# Altium schematic sheet Battery Management System.SchDoc
size A; SheetNumber: 2; SheetTotal: 3
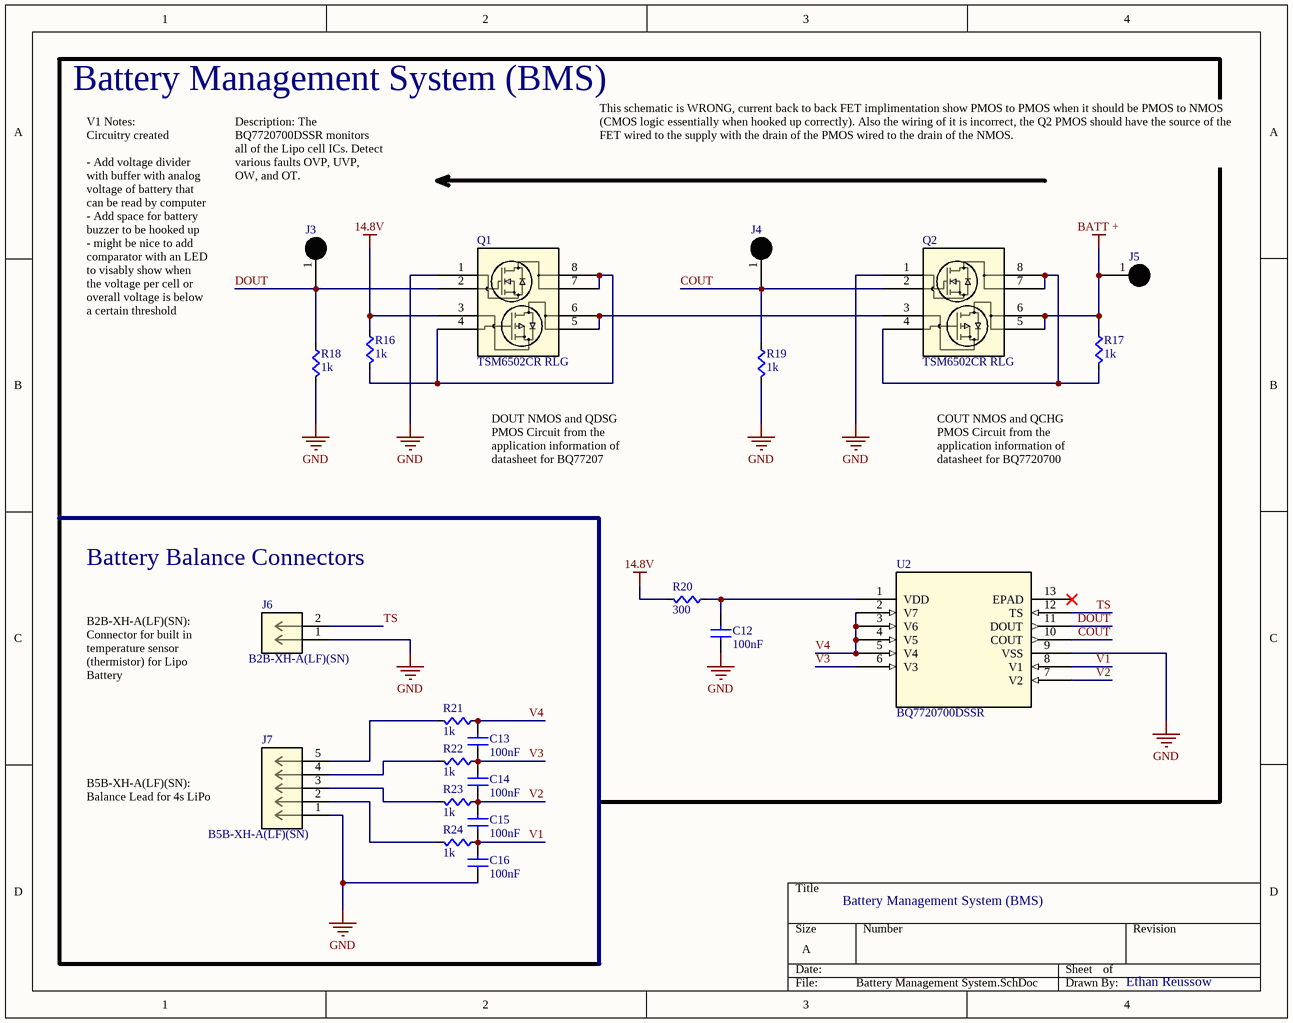
[diagram p0: Battery Management System.SchDoc]

## Parts
C12  value 100nF  [CAPC0603]  (hidden comment: Cap)
C13  value 100nF  [CAPC0603]  (hidden comment: Cap)
C14  value 100nF  [CAPC0603]  (hidden comment: Cap)
C15  value 100nF  [CAPC0603]  (hidden comment: Cap)
C16  value 100nF  [CAPC0603]  (hidden comment: Cap)
J3  5000 Test Point  [5000 Test Point]  (value not drawn)
J4  5000 Test Point  [5000 Test Point]  (value not drawn)
J5  5000 Test Point  [5000 Test Point]  (value not drawn)
J6  B2B-XH-A(LF)(SN)  [CONN_B2B-XH-A(LF)(SN)_JST]
J7  B5B-XH-A(LF)(SN)  [CONN_B5B-XH-A(LF)(SN)_JST]
Q1  TSM6502CR RLG  [PDFN56U_DUAL_TWS]
Q2  TSM6502CR RLG  [PDFN56U_DUAL_TWS]
R16  value 1k  [RES0603]  (hidden comment: Res)
R17  value 1k  [RES0603]  (hidden comment: Res)
R18  value 1k  [RES0603]  (hidden comment: Res)
R19  value 1k  [RES0603]  (hidden comment: Res)
R20  value 300  [RES0603]  (hidden comment: Res)
R21  value 1k  [RES0603]  (hidden comment: Res)
R22  value 1k  [RES0603]  (hidden comment: Res)
R23  value 1k  [RES0603]  (hidden comment: Res)
R24  value 1k  [RES0603]  (hidden comment: Res)
U2  BQ7720700DSSR  [WSON12_DSS_TEX]

## Nets
14.8V: Q1.3 R16.2(B) R20.1(A)
BATT +: J5.1 Q2.5 Q2.6 R17.2(B)
GND: C12.2(B) C16.2(B) J6.1 J7.1 Q1.1 Q2.1 R18.1(A) R19.1(A) U2.9(VSS)
COUT: J4.1 Q2.2 R19.2(B) U2.10(COUT)
DOUT: J3.1 Q1.2 R18.2(B) U2.11(DOUT)
TS: J6.2 U2.12(TS)
V1: C15.2(B) C16.1(A) R24.2(B) U2.8(V1)
V2: C14.2(B) C15.1(A) R23.2(B) U2.7(V2)
V3: C13.2(B) C14.1(A) R22.2(B) U2.6(V3)
V4: C13.1(A) R21.2(B) U2.2(V7) U2.3(V6) U2.4(V5) U2.5(V4)
NetC12_1: C12.1(A) R20.2(B) U2.1(VDD)
NetJ7_2: J7.2 R24.1(A)
NetJ7_3: J7.3 R23.1(A)
NetJ7_4: J7.4 R22.1(A)
NetJ7_5: J7.5 R21.1(A)
NetQ1_4: Q1.4 Q1.7 Q1.8 R16.1(A)
NetQ1_5: Q1.5 Q1.6 Q2.3
NetQ2_4: Q2.4 Q2.7 Q2.8 R17.1(A)

Not connected (* = marked no-connect by the designer): U2 13(EPAD)*

## Notes on the sheet
- Battery Management System (BMS)
- This schematic is WRONG, current back to back FET implimentation show PMOS to PMOS when it should be PMOS to NMOS (CMOS logic essentially when hooked up correctly). Also the wiring of it is incorrect, the Q2 PMOS should have the source of the FET wired to the supply with the drain of the PMOS wired to the drain of the NMOS.
- Flow of Power
- Description: The BQ7720700DSSR monitors all of the Lipo cell ICs. Detect various faults OVP, UVP, OW, and OT.
- V1 Notes:
  Circuitry created
  - Add voltage divider with buffer with analog voltage of battery that can be read by computer
  - Add space for battery buzzer to be hooked up
  - might be nice to add comparator with an LED to visably show when the voltage per cell or overall voltage is below a certain threshold
- DOUT NMOS and QDSG PMOS Circuit from the application information of datasheet for BQ77207
- (near R17) COUT NMOS and QCHG PMOS Circuit from the application information of datasheet for BQ7720700
- Battery Balance Connectors
- B2B-XH-A(LF)(SN): Connector for built in temperature sensor (thermistor) for Lipo Battery
- B5B-XH-A(LF)(SN):
  Balance Lead for 4s LiPo
- Ethan Reussow

## Library data of the parts
J6 = B2B-XH-A(LF)(SN): No Description Available; Mfr_Name: JST; Copyright: Copyright (C) 2023 Ultra Librarian. All rights reserved.; Manufacturer_Part_Number: B2B-XH-A(LF)(SN); RefDes: RefDes; Type: DEV
J7 = B5B-XH-A(LF)(SN): No Description Available; Mfr_Name: JST; Copyright: Copyright (C) 2023 Ultra Librarian. All rights reserved.; Manufacturer_Part_Number: B5B-XH-A(LF)(SN); RefDes: RefDes; Type: DEV
Q1 Q2 = TSM6502CR RLG: No Description Available; Mfr_Name: Taiwan Semiconductor; Type: DEV; Copyright: Copyright (C) 2023 Ultra Librarian. All rights reserved.; Manufacturer_Part_Number: TSM6502CR RLG; RefDes: RefDes
U2 = BQ7720700DSSR: No Description Available; Mfr_Name: Texas Instruments; Copyright: Copyright (C) 2023 Ultra Librarian. All rights reserved.; Manufacturer_Part_Number: BQ7720700DSSR; RefDes: RefDes; Type: DEV
C12-C16 = Cap: Supplier 1: Digi-Key; Supplier Part Number 1: 1276-1000-1-ND; ComponentLink1Description: New link; ComponentLink1URL: *
R16-R24 = Res: Supplier 1: Digi-Key; Supplier Part Number 1: RMCF0603JT10K0CT-ND